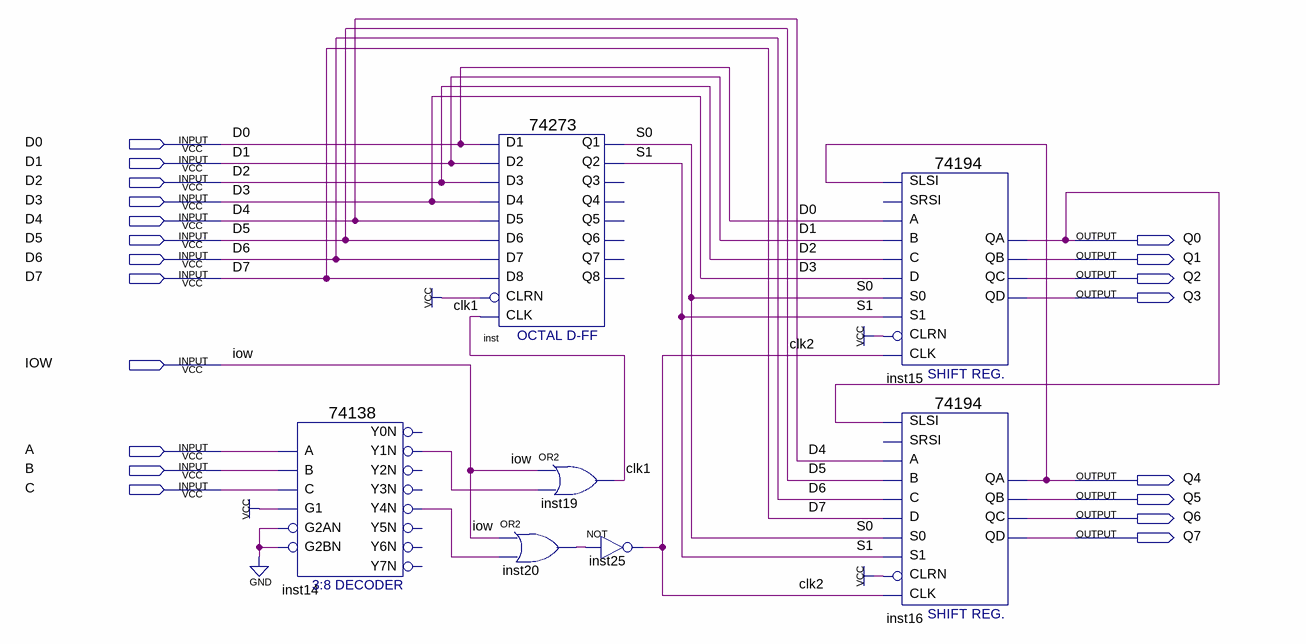
[diagram p0: schematic sheet]
// Quartus schematic project3.bdf as structural Verilog: 7 symbols, 20 pins
module project3 (
  input  D0,
  input  D1,
  input  D2,
  input  D3,
  input  D4,
  input  D5,
  input  D6,
  input  D7,
  input  IOW,
  input  A,
  input  B,
  input  C,
  output Q0,
  output Q1,
  output Q2,
  output Q3,
  output Q4,
  output Q5,
  output Q6,
  output Q7
);

  wire clk1, clk2, inst14_y1n, inst14_y4n, inst20_out, S0, S1;

  \74138  inst14 (
    .A(A), .B(B), .G1(1'b1), .C(C), .G2AN(1'b0), .G2BN(1'b0), .Y1N(inst14_y1n), .Y4N(inst14_y4n));  // open: Y0N, Y2N, Y3N, Y5N, Y6N, Y7N
  \74273  inst (
    .D2(D1), .D3(D2), .D1(D0), .D4(D3), .D7(D6), .D6(D5), .D5(D4), .D8(D7), .CLK(clk1), .CLRN(1'b1), .Q1(S0),
    .Q2(S1));  // open: Q4, Q3, Q6, Q5, Q7, Q8
  or inst19 (clk1, IOW, inst14_y1n);
  or inst20 (inst20_out, IOW, inst14_y4n);
  not inst25 (clk2, inst20_out);
  \74194  inst15 (
    .SLSI(Q4), .B(D1), .C(D2), .CLK(clk2), .CLRN(1'b1), .D(D3), .S1(S1), .S0(S0), .A(D0), .QA(Q0), .QB(Q1),
    .QC(Q2), .QD(Q3));  // open: SRSI
  \74194  inst16 (
    .SLSI(Q0), .B(D5), .C(D6), .CLK(clk2), .CLRN(1'b1), .D(D7), .S1(S1), .S0(S0), .A(D4), .QA(Q4), .QB(Q5),
    .QC(Q6), .QD(Q7));  // open: SRSI
endmodule
